# EAGLE design main v2.0 (EAGLE 9.3.0)
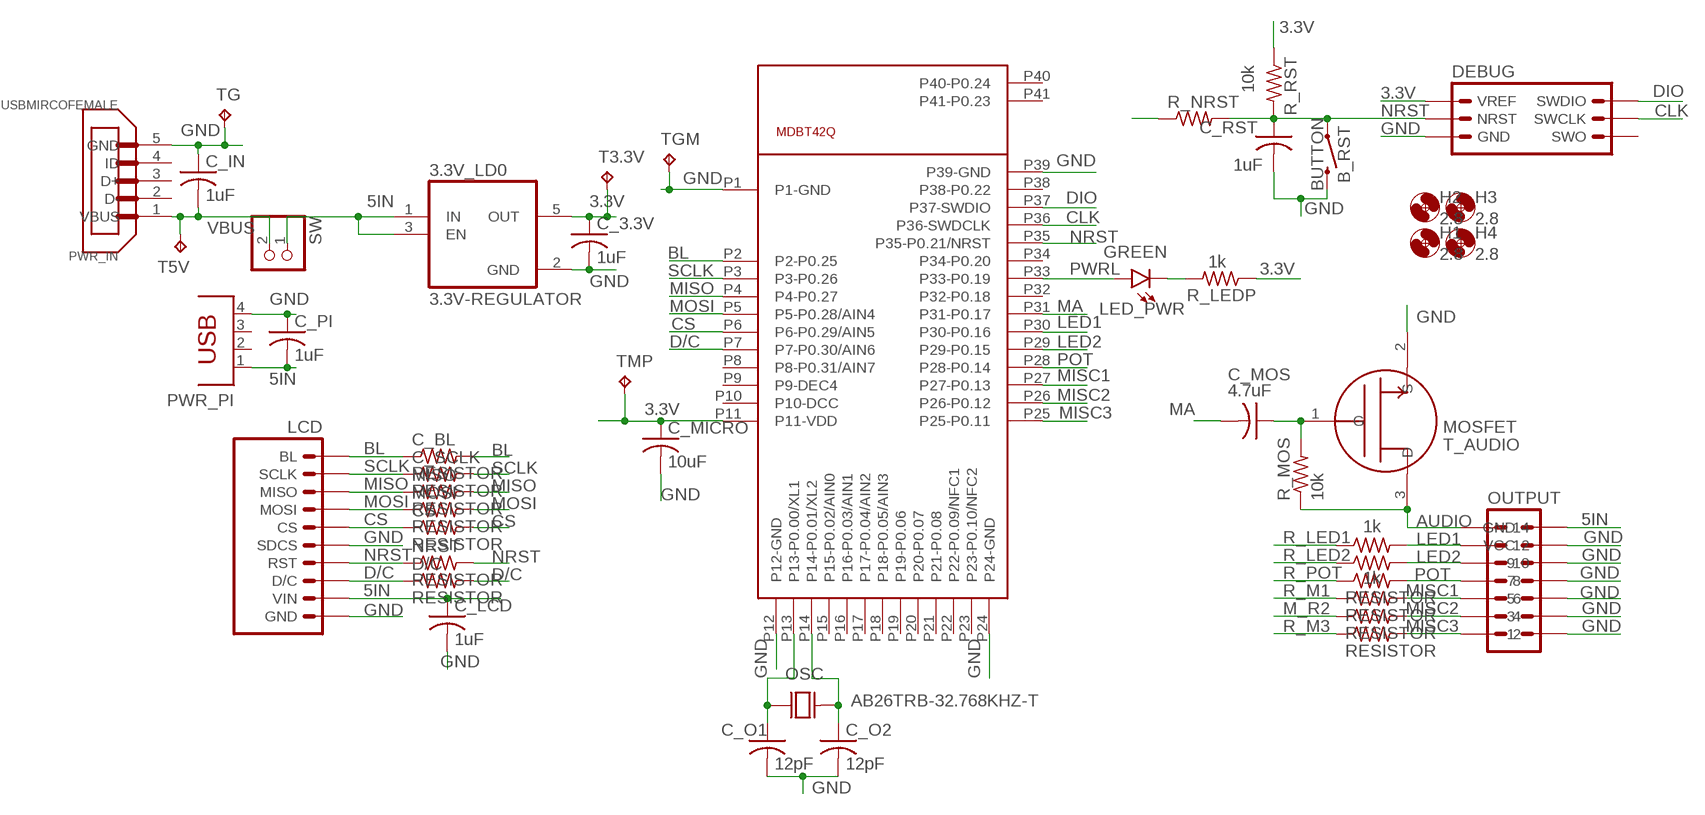
[diagram p0: schematic, sheet 1]

## Parts
3.3V_LD0  3.3V-REGULATOR  [SOT95P280X145-5N]
B_RST  BUTTON  [TACTILE_SWITCH_SMD_6.2MM_TALL]
C_3.3V  1uF  CAP  [C0805]
C_BL  RESISTOR  [R0805]
C_IN  1uF  CAP  [C0805]
C_LCD  1uF  CAP  [C0805]
C_MICRO  10uF  CAP  [C0805]
C_MOS  4.7uF  CAP  [C0805]
C_O1  12pF  CAP  [C0805]
C_O2  12pF  CAP  [C0805]
C_PI  1uF  CAP  [C0805]
C_RST  1uF  CAP  [C0805]
C_SCLK  RESISTOR  [R0805]
CS  RESISTOR  [R0805]
D/C  RESISTOR  [R0805]
DEBUG  DEBUGGER  [MA03-2]
H1  2.8  MOUNT-HOLE2.8  [2,8]
H2  2.8  MOUNT-HOLE2.8  [2,8]
H3  2.8  MOUNT-HOLE2.8  [2,8]
H4  2.8  MOUNT-HOLE2.8  [2,8]
LCD  LCDHEADERS  [MA10-1]
LED_PWR  GREEN  LED-GREENLILYPAD  [LED-1206]
M_R2  RESISTOR  [R0805]
MISO  RESISTOR  [R0805]
MOSI  RESISTOR  [R0805]
NRST  RESISTOR  [R0805]
OSC  AB26TRB-32.768KHZ-T  [XTAL_AB26TRB-32.768KHZ-T]
OUTPUT  OUTHEADER  [MA07-2]
PWR_IN  USBMIRCOFEMALE  [MOLEX_0473460001]
PWR_PI  USBCON  [PN87520]
R_LED1  1k  RESISTOR  [R0805]
R_LED2  1k  RESISTOR  [R0805]
R_LEDP  1k  RESISTOR  [R0805]
R_M1  RESISTOR  [R0805]
R_M3  RESISTOR  [R0805]
R_MOS  10k  RESISTOR  [R0805]
R_NRST  RESISTOR  [R0805]
R_POT  RESISTOR  [R0805]
R_RST  10k  RESISTOR  [R0805]
SW  PINHD-1X2  [1X02]
T3.3V  TPTP11SQ  [TP11SQ]
T5V  TPTP11SQ  [TP11SQ]
T_AUDIO  MOSFET  [SOT23]
TG  TPTP11SQ  [TP11SQ]
TGM  TPTP11SQ  [TP11SQ]
TMP  TPTP11SQ  [TP11SQ]
U$1  MDBT42Q  [MDBT40]

## Nets
3.3V [Power]: 3.3V_LD0.5(OUT) C_3.3V.1 C_MICRO.1 DEBUG.6(VREF) R_LEDP.1 R_RST.1 T3.3V.TP TMP.TP U$1.P11(P11-VDD)
5IN [Power]: 3.3V_LD0.1(IN) 3.3V_LD0.3(EN) C_LCD.1 C_PI.2 LCD.2(VIN) OUTPUT.13(GND) PWR_PI.1 SW.1
AUDIO: OUTPUT.14 R_MOS.1 T_AUDIO.3(D)
BL: C_BL.1 C_BL.2 LCD.10(BL) U$1.P2(P2-P0.25)
CLK: DEBUG.3(SWCLK) U$1.P36(P36-SWDCLK)
CS: CS.1 CS.2 LCD.6(CS) U$1.P6(P6-P0.29/AIN5)
D/C: D/C.1 D/C.2 LCD.3(D/C) U$1.P7(P7-P0.30/AIN6)
DIO: DEBUG.5(SWDIO) U$1.P37(P37-SWDIO)
GND [Power]: 3.3V_LD0.2(GND) B_RST.B1 B_RST.B2 C_3.3V.2 C_IN.1 C_LCD.2 C_MICRO.2 C_O1.2 C_O2.2 C_PI.1 C_RST.2 DEBUG.2(GND) LCD.1(GND) LCD.5(SDCS) OUTPUT.1 OUTPUT.3 OUTPUT.5 OUTPUT.7 OUTPUT.9 OUTPUT.11(VCC) PWR_IN.5(GND) PWR_PI.4 T_AUDIO.2(S) TG.TP TGM.TP U$1.P1(P1-GND) U$1.P12(P12-GND) U$1.P24(P24-GND) U$1.P39(P39-GND)
LED1: OUTPUT.12 R_LED1.1 R_LED1.2 U$1.P30(P30-P0.16)
LED2: OUTPUT.10 R_LED2.1 R_LED2.2 U$1.P29(P29-P0.15)
MA: C_MOS.2 U$1.P31(P31-P0.17)
MISC1: OUTPUT.6 R_M1.1 R_M1.2 U$1.P27(P27-P0.13)
MISC2: M_R2.1 M_R2.2 OUTPUT.4 U$1.P26(P26-P0.12)
MISC3: OUTPUT.2 R_M3.1 R_M3.2 U$1.P25(P25-P0.11)
MISO: LCD.8(MISO) MISO.1 MISO.2 U$1.P4(P4-P0.27)
MOSI: LCD.7(MOSI) MOSI.1 MOSI.2 U$1.P5(P5-P0.28/AIN4)
N$1: C_O1.1 OSC.1 U$1.P13(P13-P0.00/XL1)
N$2: C_O2.1 OSC.2 U$1.P14(P14-P0.01/XL2)
N$3: C_MOS.1 R_MOS.2 T_AUDIO.1(G)
N$6: LED_PWR.C R_LEDP.2
NRST: B_RST.A1 B_RST.A2 C_RST.1 DEBUG.4(NRST) LCD.4(RST) NRST.1 NRST.2 R_NRST.1 R_NRST.2 R_RST.2 U$1.P35(P35-P0.21/NRST)
POT: OUTPUT.8 R_POT.1 R_POT.2 U$1.P28(P28-P0.14)
PWRL: LED_PWR.A U$1.P33(P33-P0.19)
SCLK: C_SCLK.1 C_SCLK.2 LCD.9(SCLK) U$1.P3(P3-P0.26)
VBUS [Power]: C_IN.2 PWR_IN.1(VBUS) SW.2 T5V.TP
Unconnected: DEBUG.1(SWO) PWR_IN.2(D-) PWR_IN.3(D+) PWR_IN.4(ID) PWR_PI.2 PWR_PI.3 U$1.P8(P8-P0.31/AIN7) U$1.P9(P9-DEC4) U$1.P10(P10-DCC) U$1.P15(P15-P0.02/AIN0) U$1.P16(P16-P0.03/AIN1) U$1.P17(P17-P0.04/AIN2) U$1.P18(P18-P0.05/AIN3) U$1.P19(P19-P0.06) U$1.P20(P20-P0.07) U$1.P21(P21-P0.08) U$1.P22(P22-P0.09/NFC1) U$1.P23(P23-P0.10/NFC2) U$1.P32(P32-P0.18) U$1.P34(P34-P0.20) U$1.P38(P38-P0.22) U$1.P40(P40-P0.24) U$1.P41(P41-P0.23)

## Library data of the parts
3.3V_LD0 = third_eye:3.3V-REGULATOR: 500mA Low-IQ Small-Size Low-Dropout (LDO) Regulator 5-SOT-23 -40 to 125; AVAILABILITY: Unavailable; DESCRIPTION: 500mA Low-IQ Small-Size Low-Dropout _LDO_ Regulator 5-SOT-23 -40 to 125; MF: Texas Instruments; MP: TLV75533PDBVR; PACKAGE: SOT-23 Texas Instruments; PRICE: None
B_RST = third_eye:BUTTON
C_3.3V C_IN C_LCD C_MICRO C_MOS C_O1 C_O2 C_PI C_RST = third_eye:CAP
C_BL C_SCLK CS D/C M_R2 MISO MOSI NRST R_LED1 R_LED2 R_LEDP R_M1 R_M3 R_MOS R_NRST R_POT R_RST = third_eye:RESISTOR
DEBUG = third_eye:DEBUGGER: PIN HEADER; OC_FARNELL: unknown; OC_NEWARK: unknown
H1-H4 = third_eye:MOUNT-HOLE: MOUNTING HOLE with drill center marker
LCD = third_eye:LCDHEADERS: PIN HEADER; OC_FARNELL: unknown; OC_NEWARK: unknown
LED_PWR = third_eye:LED-GREEN: Green SMD LED Used in manufacturing of various products at SparkFun Packages: 0603 - SMD 0603 package [Product Link] <http://www.futureelectronics.com/en/technologies/semiconductors/optoelectronics/leds/Pages/9894312-LTST-C190GKT.aspx?CrossPart=HSMG-C190&IM=0> LilyPad 1206 - SMD1206 LilyPad package [Product Link] <http://www.futureelectronics.com/en/Technologies/Product.aspx?ProductID=IN150NGHARVATEKCORPORATION2049943&IM=0> 1206 - SMD1206 package [Product Link] <http://www.futureelectronics.com/en/technologies/semiconductors/optoelectronics/leds/Pages/8315665-LTST-C150KGKT.aspx?IM=0> 1206 Bottom Mount -SMD 1206 Bottom Mount [Product Link] <http://www.digikey.com/product-detail/en/lite-on-inc/LTST-C230KGKT/160-1456-1-ND/386854> SparkFun Products: Pro Mini 328 -5V <https://www.sparkfun.com/products/821> RedBoard <https://www.sparkfun.com/products/12757> MP3 Trigger <https://www.sparkfun.com/products/13720> Makey Makey <https://www.sparkfun.com/products/11076>; PROD_ID: DIO-09910
OSC = third_eye:AB26TRB-32.768KHZ-T: AB26TRB Series 32.768 kHz ±20 ppm 12.5 pF -40 to +85°C Cylindrical Watch Crystal; DESCRIPTION: AB26TRB Series 32.768 kHz ±20 ppm 12.5 pF -40 to +85°C Cylindrical Watch Crystal; DIGI-KEY_PART_NUMBER: 535-9033-1-ND; DIGI-KEY_PURCHASE_URL: https://www.digikey.com/product-detail/en/abracon-llc/AB26TRB-32.768KHZ-T/535-9033-1-ND/675581?utm_source=snapeda&utm_medium=aggregator&utm_campaign=symbol; MF: Abracon; MP: AB26TRB-32.768KHZ-T; PACKAGE: Cylindrical Can Radial Abracon
OUTPUT = third_eye:OUTHEADER: PIN HEADER; OC_FARNELL: unknown; OC_NEWARK: unknown
PWR_IN = third_eye:USBMIRCOFEMALE: Conn Micro USB Type B RCP 5 POS 0.65mm Solder RA SMD 5 Terminal 1 Port T/R; AVAILABILITY: Unavailable; DESCRIPTION: Conn Micro USB Type B RCP 5 POS 0.65mm Solder RA SMD 5 Terminal 1 Port T/R; MF: Weidmuller; MP: 0473460001; PACKAGE: None; PRICE: None
PWR_PI = third_eye:USBCON: BERG USB connector; OC_FARNELL: unknown; OC_NEWARK: unknown
SW = pinhead:PINHD-1X2: PIN HEADER
T3.3V T5V TG TGM TMP = third_eye:TP: Test pad
T_AUDIO = third_eye:MOSFET
U$1 = third_eye:MDBT42Q

## Net classes
0 default: width 0.203 mm
1 Power: width 0.305 mm

## Board
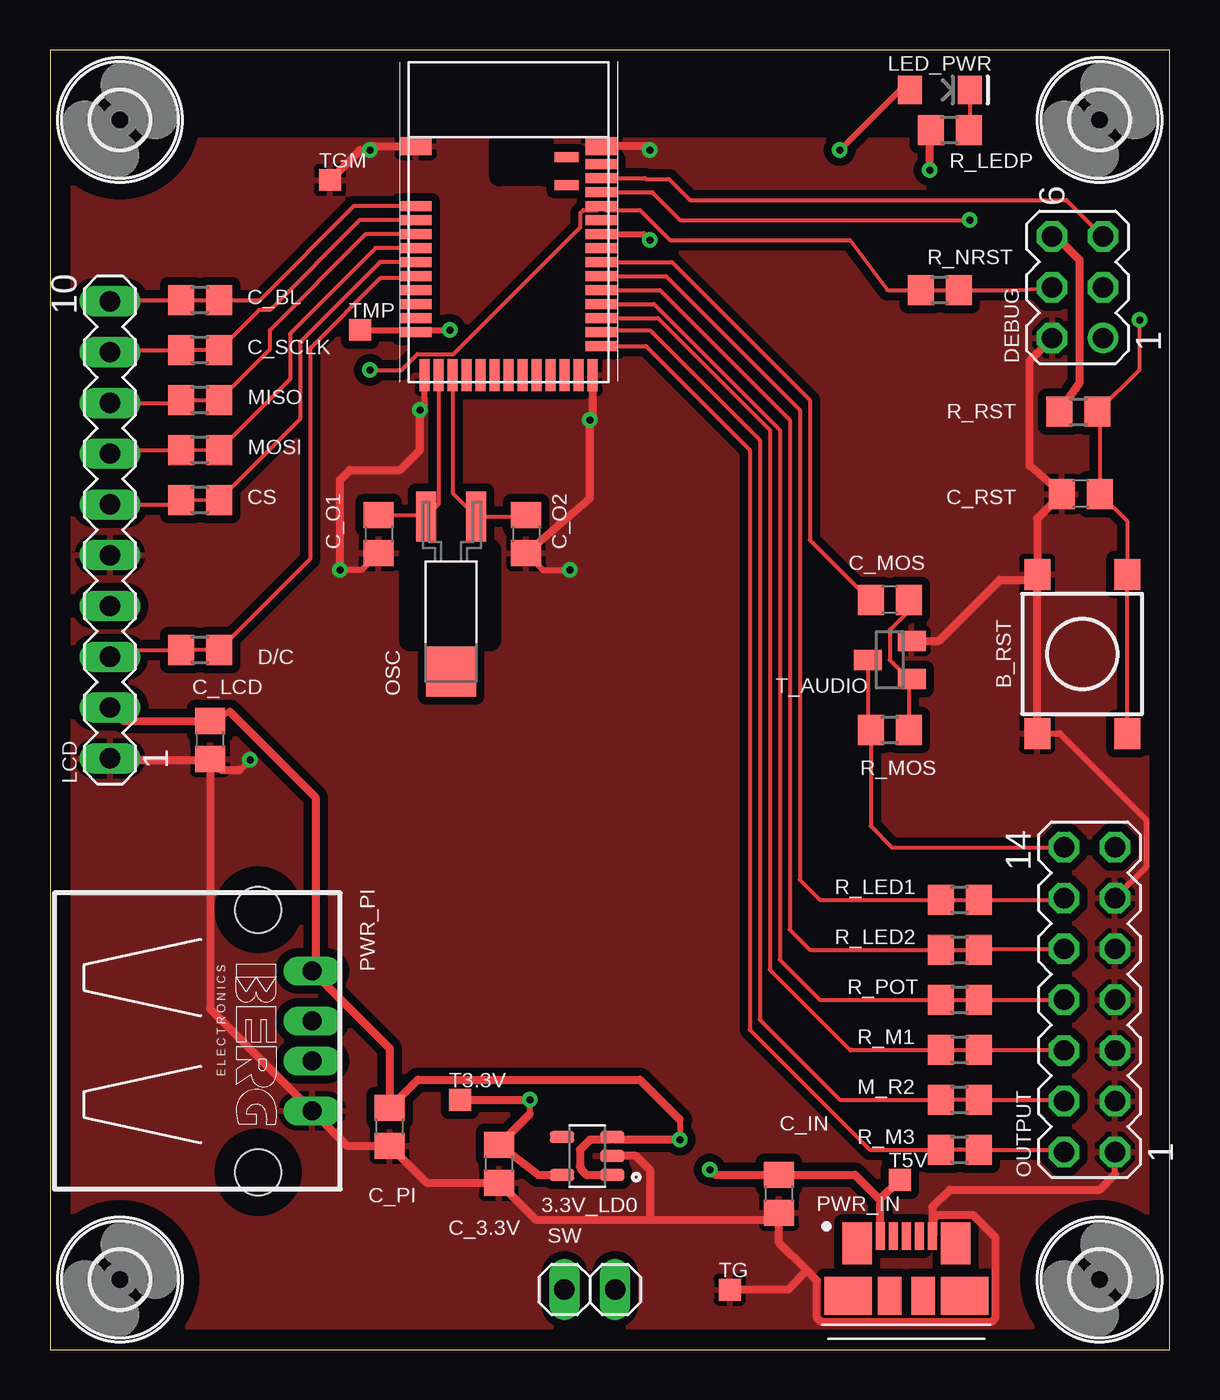
[diagram p1: board, top side]
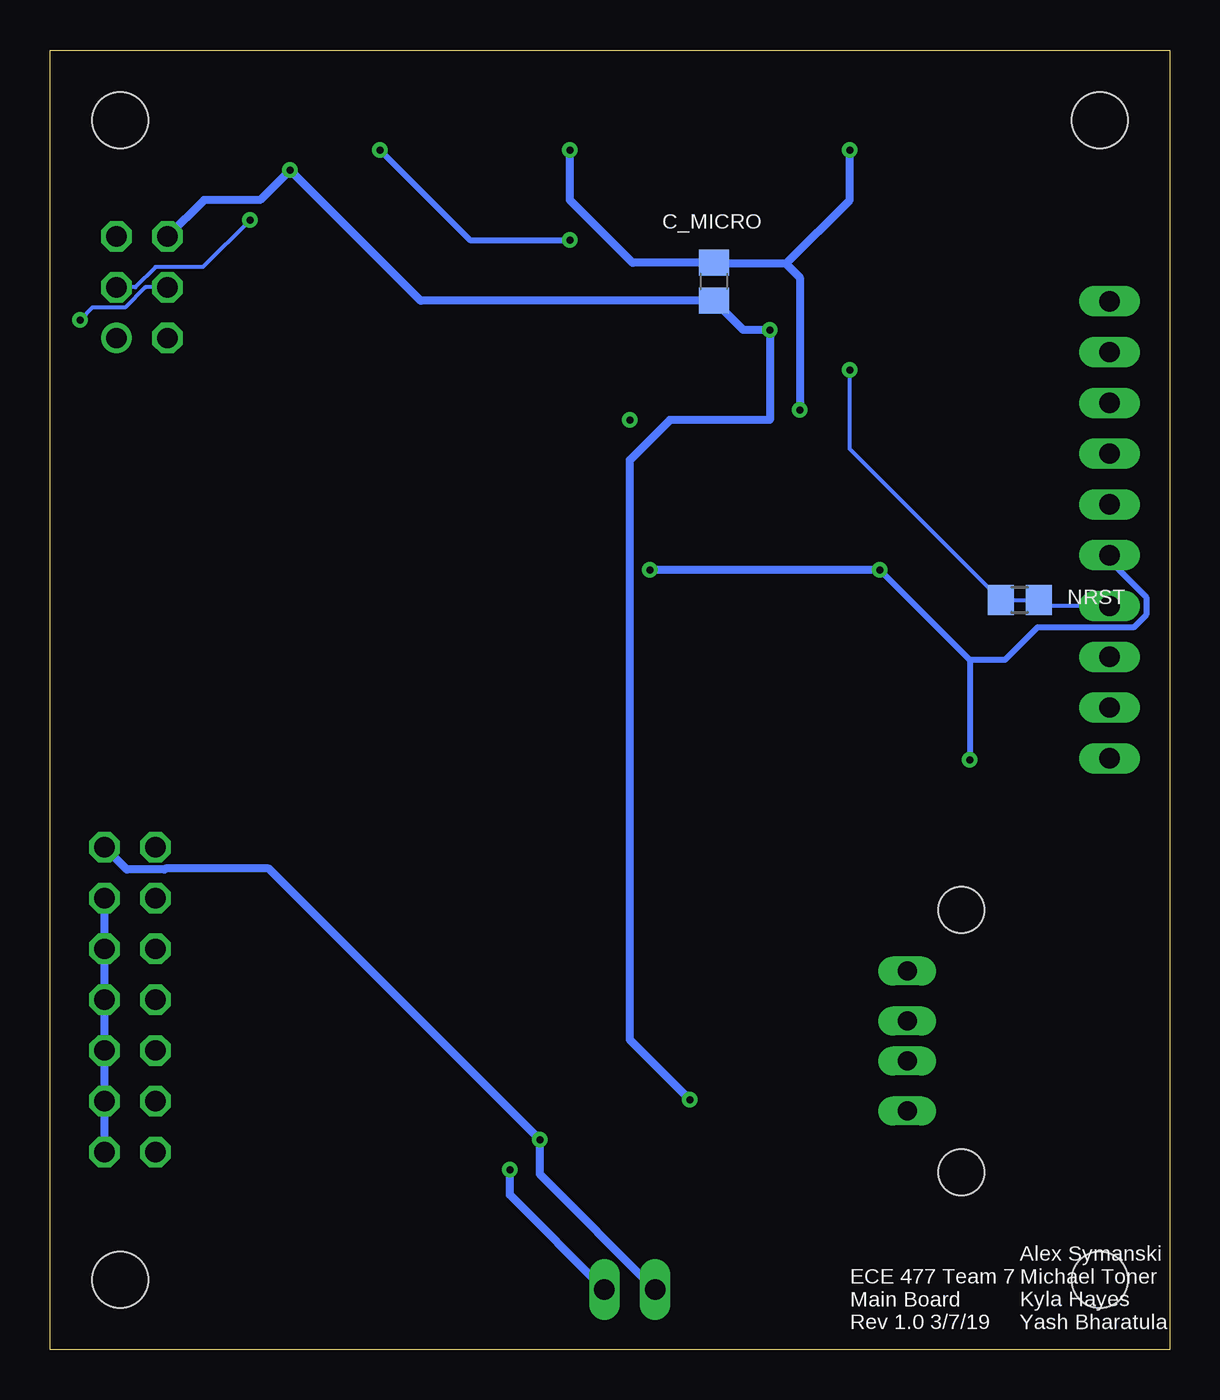
[diagram p2: board, bottom side, seen from below]

Size 56 x 65 mm. Coordinates in mm from the lower left corner, seen from the top.
Outline: 0,0 56,0 56,65 0,65 0,0
Copper layers (1*16): Top 0.035mm / dielectric 1.5mm / Bottom 0.035mm
Design rules "default": minimum track width 6mil, minimum drill 0.35mm, track to track 6mil, track to pad 6mil, pad to pad 6mil, via to via 6mil, smd to smd 6mil, copper to edge 40mil, drill to drill 6mil, minimum pad ring 10mil, minimum via ring 8mil, stop-mask expansion 4mil, vias tented up to drill 0mil, thermal gap 10mil
tRestrict: area 18,35.5 to 22,40

### Footprints (pad centres in the part's own frame; a part is rotated, then mirrored left to right if it is on the bottom)
SOT95P280X145-5N = smd 1.21 x 0.59: 1 -1.255,0.95; 2 -1.255,0; 3 -1.255,-0.95; 4 1.255,-0.95; 5 1.255,0.95
TACTILE_SWITCH_SMD_6.2MM_TALL = smd 1.55 x 1.3: A1 -3.975,-2.25; A2 3.975,-2.25; B1 -3.975,2.25; B2 3.975,2.25
C0805 = smd 1.3 x 1.5: 1 -0.95,0; 2 0.95,0
R0805 = smd 1.3 x 1.5: 1 -0.95,0; 2 0.95,0
MA03-2 = drill 1.016: 1 -2.54,-1.27 | drill 1.016 octagon: 2 -2.54,1.27; 3 0,-1.27; 4 0,1.27; 5 2.54,-1.27; 6 2.54,1.27
2,8 = hole 2.8: 0,0
MA10-1 = drill 1.016 long: 1 -11.43,0; 2 -8.89,0; 3 -6.35,0; 4 -3.81,0; 5 -1.27,0; 6 1.27,0; 7 3.81,0; 8 6.35,0; 9 8.89,0; 10 11.43,0
LED-1206 = smd 1.2 x 1.4: A -1.5,0; C 1.5,0
XTAL_AB26TRB-32.768KHZ-T = smd 2.5 x 1: 1 3.875,1.25; 2 3.875,-1.25 | smd 2.5 x 2.5: 3 -3.875,0
MA07-2 = drill 1.016 octagon: 1 -7.62,-1.27; 2 -7.62,1.27; 3 -5.08,-1.27; 4 -5.08,1.27; 5 -2.54,-1.27; 6 -2.54,1.27; 7 0,-1.27; 8 0,1.27; 9 2.54,-1.27; 10 2.54,1.27; 11 5.08,-1.27; 12 5.08,1.27; 13 7.62,-1.27; 14 7.62,1.27
MOLEX_0473460001 = smd 0.45 x 1.38: 1 -1.3,0; 2 -0.65,0; 3 0,0; 4 0.65,0; 5 1.3,0 | smd 1.475 x 2.1: P1 -2.462,-0.36; P2 2.462,-0.36 | smd 2.375 x 1.9: P3 -2.913,-2.99; P6 2.913,-2.99 | smd 1.175 x 1.9: P4 -0.838,-2.99; P5 0.838,-2.99
PN87520 = drill 0.95 long: 1 -3.5,2.71; 2 -1,2.71; 3 1,2.71; 4 3.5,2.71 | hole 2.3: -6.57,0; 6.57,0
1X02 = drill 1.016 long: 1 -1.27,0; 2 1.27,0
TP11SQ = smd 1.1 x 1.1: TP 0,0
SOT23 = smd 1 x 1.4: 1 -0.95,-1.1; 2 0.95,-1.1; 3 0,1.1
MDBT40 = smd 1.6 x 0.9: P1 -4.65,3.8; P39 4.65,3.8 | smd 1.6 x 0.5: P2 -4.65,0.8; P3 -4.65,0.1; P4 -4.65,-0.6; P5 -4.65,-1.3; P6 -4.65,-2; P7 -4.65,-2.7; P8 -4.65,-3.4; P9 -4.65,-4.1; P10 -4.65,-4.8; P11 -4.65,-5.5; P25 4.65,-6.2; P26 4.65,-5.5; P27 4.65,-4.8; P28 4.65,-4.1; P29 4.65,-3.4; P30 4.65,-2.7; P31 4.65,-2; P32 4.65,-1.3; P33 4.65,-0.6; P34 4.65,0.1; P35 4.65,0.8; P36 4.65,1.5; P37 4.65,2.2; P38 4.65,2.9 | smd 0.5 x 1.6: P12 -4.2,-7.65; P13 -3.5,-7.65; P14 -2.8,-7.65; P15 -2.1,-7.65; P16 -1.4,-7.65; P17 -0.7,-7.65; P18 0,-7.65; P19 0.7,-7.65; P20 1.4,-7.65; P21 2.1,-7.65; P22 2.8,-7.65; P23 3.5,-7.65; P24 4.2,-7.65 | smd 1.2 x 0.5: P40 2.9,3.25; P41 2.9,1.85

### Placement (x,y rotation side)
3.3V_LD0  26.87,9.68 180 top
B_RST  51.63,34.79 90 top
C_3.3V  22.45,9.3 270 top
C_BL  7.5,52.5 0 top
C_IN  36.47,7.8 90 top
C_LCD  8,30.5 270 top
C_MICRO  22.78,53.41 90 bottom
C_MOS  42,37.5 180 top
C_O1  16.44,40.8 270 top
C_O2  23.82,40.8 270 top
C_PI  16.99,11.15 90 top
C_RST  51.56,42.8 180 top
C_SCLK  7.5,50 0 top
CS  7.5,42.5 0 top
D/C  7.5,35 0 top
DEBUG  51.4,53.13 90 top
H1  52.5,3.5 0 top
H2  52.5,61.5 0 top
H3  3.5,61.5 0 top
H4  3.5,3.5 0 top
LCD  3,41 90 top
LED_PWR  44.5,63 0 top
M_R2  45.5,12.5 0 top
MISO  7.5,47.5 0 top
MOSI  7.5,45 0 top
NRST  7.5,37.5 0 bottom
OSC  20.06,37.79 90 top
OUTPUT  52,17.5 90 top
PWR_IN  42.83,5.67 0 top
PWR_PI  10.41,15.43 270 top
R_LED1  45.5,22.5 0 top
R_LED2  45.5,20 0 top
R_LEDP  45,61 0 top
R_M1  45.5,15 0 top
R_M3  45.5,10 0 top
R_MOS  42,31 0 top
R_NRST  44.5,53 0 top
R_POT  45.5,17.5 0 top
R_RST  51.44,46.91 0 top
SW  27,3 0 top
T3.3V  20.5,12.5 0 top
T5V  42.5,8.5 0 top
T_AUDIO  42,34.5 90 top
TG  34,3 0 top
TGM  14,58.5 0 top
TMP  15.5,51 0 top
U$1  22.94,56.39 0 top

### Tracks (layer width: path | path; a pad name or v marks a point on that pad's centre or on a via)
3.3V  (via drill 0.35)
  Top 0.305: v20,51 18.4,51 U$1.P11 18.18,51 TMP.TP | 44,60.95 R_LEDP.1 | 24,11.8 v24,12.5
  Top 0.406: 3.3V_LD0.5 24.42,8.73 C_3.3V.1 24,11.8 | R_RST.1 51.5,48.37 51.5,54.5 50.33,55.67 DEBUG.6 | v44,59 44,60.95 | T3.3V.TP v24,12.5
  Bottom 0.406: v24,12.5 27,15.5 27,44.5 25,46.5 20,46.5 v20,51 21.32,51 C_MICRO.1 37.46,52.46 v44,59 45.5,57.5 48.3,57.5 DEBUG.6
5IN  (via drill 0.35)
  Top 0.305: PWR_PI.1 13.28,18.77 | C_LCD.1 9,31.9 | LCD.2 3.66,31.45 | 28.25,10.5 3.3V_LD0.3 | 31.5,11.5 v31.5,10.5
  Top 0.406: 9,31.9 13.28,27.62 13.28,18.77 | 3.66,31.45 C_LCD.1 | PWR_PI.1 16.99,15.06 C_PI.2 18.39,13.5 29.5,13.5 31.5,11.5 | v31.5,10.5 28.25,10.5 | 3.3V_LD0.3 28,10.5 27,10.5 26.5,10 26.5,9.16 26.58,9.09 26.58,9 26.85,8.73 3.3V_LD0.1
  Bottom 0.406: SW.1 31.5,8.77 v31.5,10.5 45.05,24.05 50.22,24.05 50.27,24 52.15,24 OUTPUT.13
AUDIO
  Top 0.203: OUTPUT.14 42.11,25.12 41.05,26.18 R_MOS.1 40.9,31.15 T_AUDIO.3
BL
  Top 0.203: U$1.P2 15.19,57.19 10.5,52.5 C_BL.2 C_BL.1 3.07,52.5 LCD.10
CLK  (via drill 0.35)
  Top 0.203: U$1.P36 30.11,57.89 31.5,56.5 v46,56.5
  Bottom 0.203: DEBUG.3 51.74,53.13 50.72,54.15 48.35,54.15 v46,56.5
CS
  Top 0.203: U$1.P6 16.5,54.39 12.5,50.39 12.5,46.55 CS.2 6.53,42.48 | LCD.6 6.32,42.27 6.53,42.48 | 6.53,42.48 CS.1
D/C
  Top 0.203: U$1.P7 18.22,53.69 18.11,53.59 16.51,53.59 13,50.07 13,39.55 D/C.2 D/C.1 3.35,35 LCD.3
DIO
  Top 0.203: U$1.P37 29.75,58.59 29.8,58.55 30.95,58.55 32,57.5 50.84,57.5 DEBUG.5
GND  (via drill 0.35)
  Top 0.305: 27.14,46.64 v27,46.5 | 8,29.5 C_LCD.2 8.55,29 | 49.38,38.5 B_RST.B2 | 16.19,60.19 v16,60 15.5,60 | v30,60 29.81,60.19 | v18.5,47 18.74,47.24 U$1.P12 | OUTPUT.11 54.83,24.14 54.83,26.5 50.52,30.82 B_RST.B1 | LCD.1 3.07,29.5 | C_O1.2 15.59,39 v14.5,39 | C_O2.2 24.67,39 v26,39 | 53.27,8.77 OUTPUT.1 | 9.5,29 v10,29.5 | C_IN.1 36.47,6.5
  Top 0.406: U$1.P24 27.14,46.64 | C_O2.2 27,42.58 v27,46.5 | B_RST.B1 49.38,38.5 47.5,38.5 44.45,35.45 T_AUDIO.2 | DEBUG.2 49,49.46 49,44.21 C_RST.2 49.38,41.57 B_RST.B2 | 16.19,60.19 U$1.P1 | 29.81,60.19 U$1.P39 | v18.5,47 18.5,45 17.5,44 15,44 14.5,43.5 v14.5,39 | 3.07,29.5 8,29.5 8,17.05 PWR_PI.4 14.85,10.2 C_PI.1 18.84,8.35 C_3.3V.2 24.3,6.5 30,6.5 | 53.27,8.77 52.5,8 45,8 44.13,7.13 PWR_IN.5 44.2,5.74 44.2,6.51 44.41,6.72 46.18,6.72 47.29,5.61 47.29,1.58 47.08,1.37 38.58,1.37 38.37,1.58 38.37,3.45 37.87,3.96 | 3.3V_LD0.2 29.32,9.68 30,9 30,6.5 | 8.55,29 9.5,29 | 15.5,60 TGM.TP | 30,6.5 36.47,6.5 | 37.87,3.96 36.47,5.35 C_IN.1 | 37.87,3.96 36.91,3 TG.TP
  Bottom 0.305: v14.5,39 10,34.5 | 10,34.5 v10,29.5 | 22.73,54.31 C_MICRO.2 | 10,34.5 8.23,34.5 6.61,36.12 1.8,36.12 1.17,36.75 1.17,37.63 3,39.46
  Bottom 0.406: OUTPUT.1 OUTPUT.3 OUTPUT.5 OUTPUT.7 OUTPUT.9 OUTPUT.11 | v30,60 30,57.5 26.86,54.36 C_MICRO.2 | v16,60 16,57.5 19.19,54.31 | 19.19,54.31 18.5,53.62 v18.5,47 | v14.5,39 v26,39 | 19.19,54.31 22.73,54.31 | LCD.5 3,39.46
  pour Top (isolate 0.406): 0,60.5 56,60.5 56,0 0,0
LED1
  Top 0.203: U$1.P30 30.81,53.69 37.5,47 37.5,23.5 38.5,22.5 R_LED1.1 R_LED1.2 50.65,22.5 OUTPUT.12
LED2
  Top 0.203: U$1.P29 30.51,52.99 37,46.5 37,21 38,20 R_LED2.1 R_LED2.2 46.94,20.04 OUTPUT.10
MA
  Top 0.203: U$1.P31 31.11,54.39 38,47.5 38,40.5 41,37.5 C_MOS.2
MISC1
  Top 0.203: U$1.P27 30.41,51.59 36,46 36,19 40.04,14.96 40.08,15 R_M1.1 R_M1.2 46.5,15 50.69,15 OUTPUT.6
MISC2
  Top 0.203: U$1.P26 27.66,50.96 30.04,50.96 35.5,45.5 35.5,16.5 39.5,12.5 M_R2.1 M_R2.2 50.65,12.5 OUTPUT.4
MISC3
  Top 0.203: U$1.P25 29.81,50.19 35,45 35,16 41,10 R_M3.1 R_M3.2 50.61,10 OUTPUT.2
MISO
  Top 0.203: U$1.P4 15.79,55.79 11,51 11,50.05 MISO.2 MISO.1 6.4,47.35 LCD.8
MOSI
  Top 0.203: U$1.P5 16.28,55.09 12,50.81 12,48.55 8.47,45.02 | LCD.7 3.19,45 MOSI.1 8.47,45.02 | 8.47,45.02 MOSI.2
N$1
  Top 0.203: U$1.P13 19.44,42.3 18.89,41.75 | 18.89,41.75 OSC.1 | C_O1.1 18.89,41.75
N$2
  Top 0.203: U$1.P14 20.14,42.84 OSC.2 23.29,41.66 C_O2.1
N$3
  Top 0.203: T_AUDIO.1 43.02,33.48 | 43.02,33.48 42.95,33.4 R_MOS.2 | C_MOS.1 42.95,36.95 42,36 42,34.5 43.02,33.48
N$6
  Top 0.203: LED_PWR.C 46,61.05 R_LEDP.2
NRST  (via drill 0.35)
  Top 0.203: B_RST.A1 B_RST.A2 53.88,41.43 C_RST.1 52.51,46.79 R_RST.2 54.5,49.02 v54.5,51.5 | v16,49 17.59,49 18.39,49.79 20.19,49.79 26.54,56.14 26.54,56.84 26.68,56.99 27.39,56.99 U$1.P35 27.78,57 29.5,57 31,55.5 40,55.5 41.88,53 R_NRST.1 R_NRST.2 48.5,53 DEBUG.4
  Bottom 0.203: DEBUG.4 51.23,53.13 52.25,52.11 53.89,52.11 v54.5,51.5 | LCD.4 6.24,37.19 NRST.2 NRST.1 16,45.05 v16,49
POT
  Top 0.203: U$1.P28 30.21,52.29 36.5,46 36.5,19.5 38.5,17.5 R_POT.1 R_POT.2 OUTPUT.8
PWRL  (via drill 0.35)
  Top 0.305: U$1.P33 29.71,55.79 v30,55.5 | LED_PWR.A 42.5,63 v39.5,60
  Bottom 0.305: v39.5,60 35,55.5 v30,55.5
SCLK
  Top 0.203: U$1.P3 15.49,56.49 11,52 10.45,52 C_SCLK.2 C_SCLK.1 3.11,50 LCD.9
VBUS  (via drill 0.35)
  Top 0.305: 41.53,7.47 41.53,7.53 | v33,9 33.25,8.75
  Top 0.406: PWR_IN.1 41.53,7.47 40.25,8.75 C_IN.2 33.25,8.75 | 41.53,7.53 T5V.TP
  Bottom 0.406: SW.2 33,7.73 v33,9

### Text on the board
bPlace: Alex Symanski / Michael Toner / Kyla Hayes / Yash Bharatula | ECE 477 Team 7 / Main Board / Rev 1.0 3/7/19